# EAGLE design radish (EAGLE 4.16)

## Sheet 1 of 2
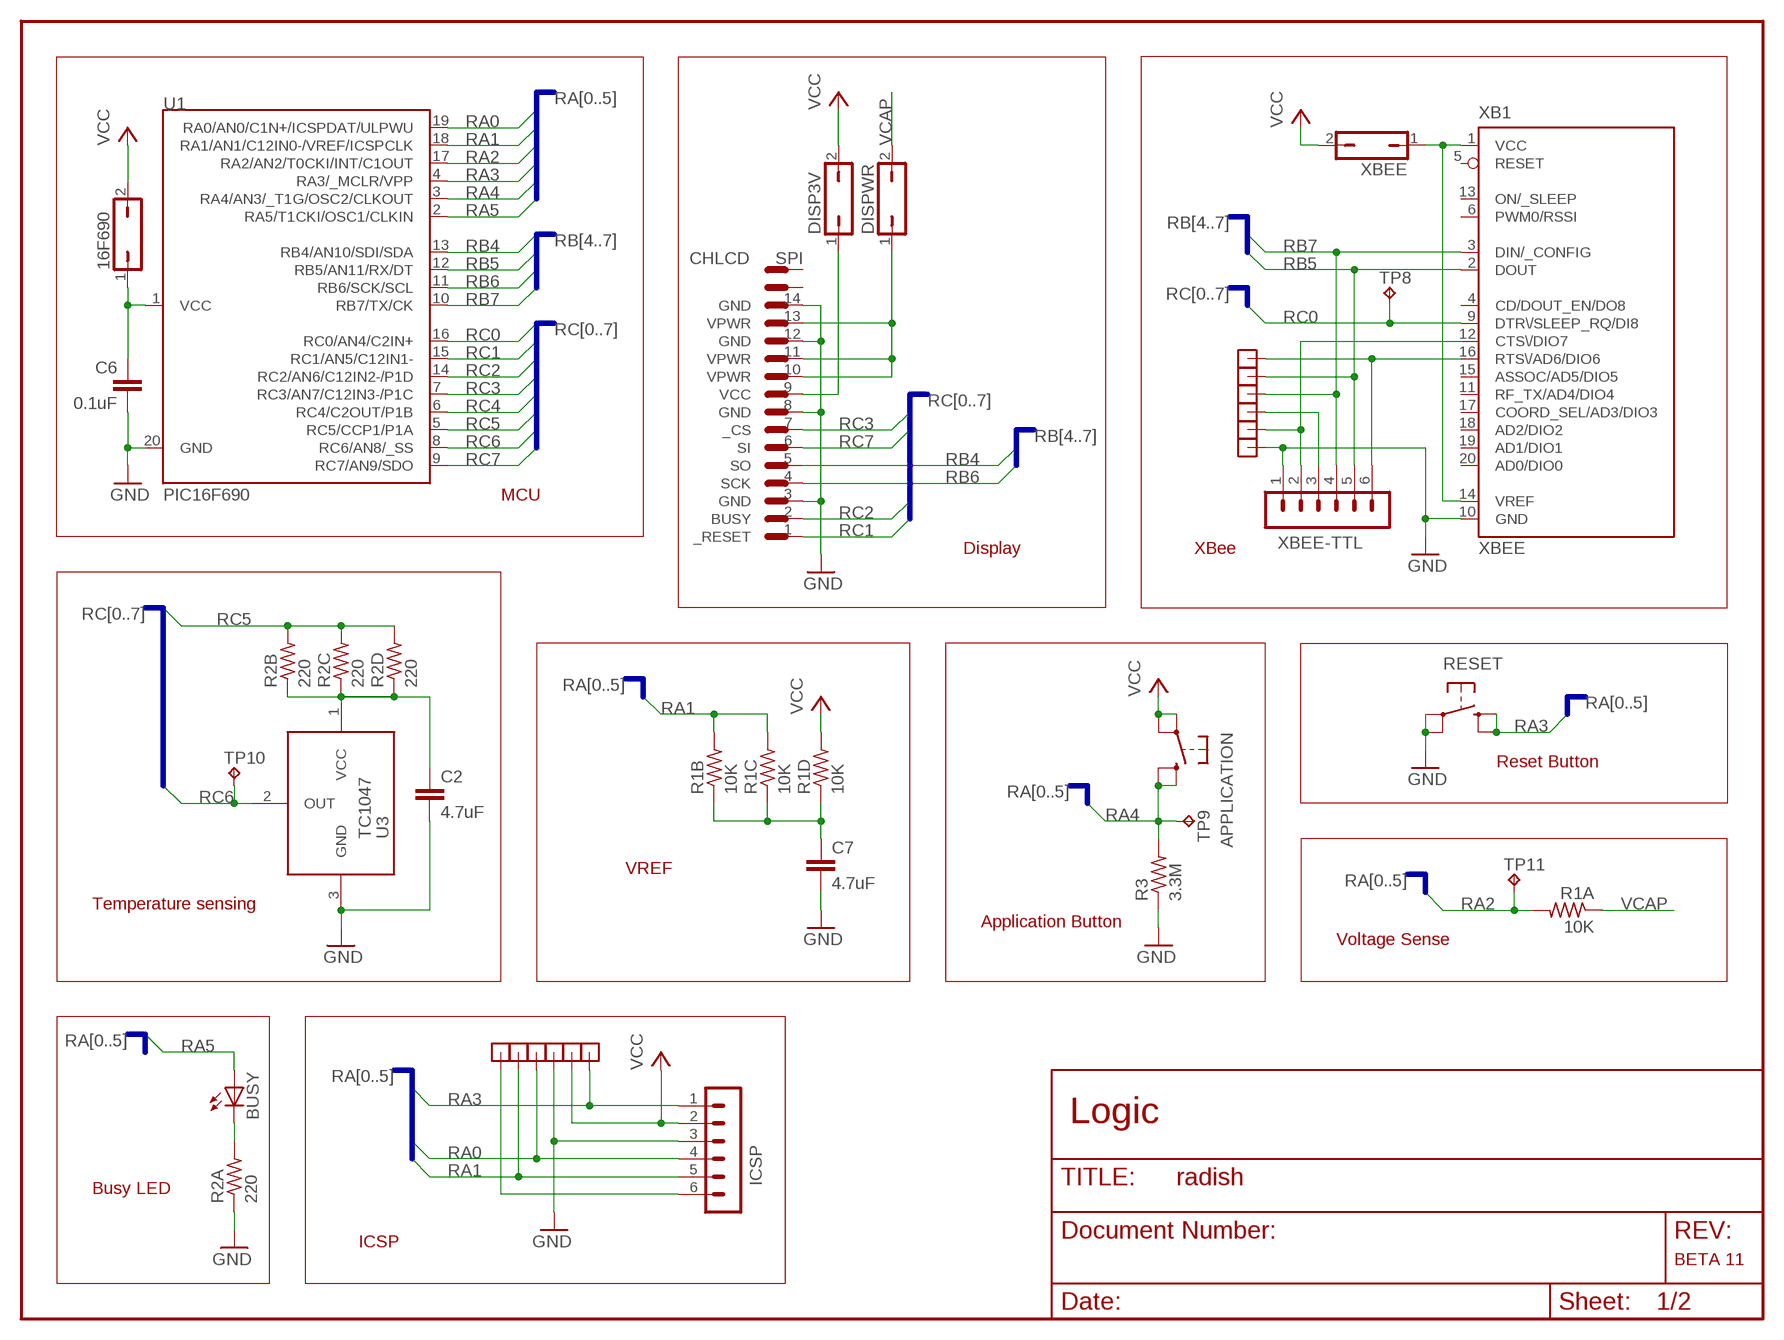
[diagram p0: schematic, sheet 1]

### Parts
16F690  JUMPER  [J0805]
APPLICATION  TL3301G  [TL3301*G]
BUSY  LEDCHIP-LED0805  [CHIP-LED0805]
C2  4.7uF  C-EUC0805  [C0805]
C6  0.1uF  C-EUC0805  [C0805]
C7  4.7uF  C-EUC0805  [C0805]
DISP3V  JUMPER  [J0805]
DISPWR  JUMPER  [J0805]
ICSP  SMT06-1  [SMT06-1]
R1  10K  CN1J4  [CN1J_NETWORK]
R2  220  CN1J4  [CN1J_NETWORK]
R3  3.3M  R-US_R0805  [R0805]
RESET  TL3301G  [TL3301*G]
SPI  CHLCD  SPI-LCDSMT  [16FMN-SMT-A-TF(LF)(SN)]
TP8  TPTP10R  [TP10R]
TP9  TPTP10R  [TP10R]
TP10  TPTP10R  [TP10R]
TP11  TPTP10R  [TP10R]
U1  PIC16F690  PIC16F690SOIC  [SOIC20S]
U3  TC1047  TEMP-SENSORSOT23  [SOT23]
X1  TESTPADROUND  [TESTPAD-ROUND]
X2  TESTPAD"  [TESTPAD-SQUARE]
X3  TESTPAD"  [TESTPAD-SQUARE]
X4  TESTPAD"  [TESTPAD-SQUARE]
X5  TESTPAD"  [TESTPAD-SQUARE]
X6  TESTPAD"  [TESTPAD-SQUARE]
X7  TESTPADROUND  [TESTPAD-ROUND]
X8  TESTPAD"  [TESTPAD-SQUARE]
X9  TESTPAD"  [TESTPAD-SQUARE]
X10  TESTPAD"  [TESTPAD-SQUARE]
X11  TESTPAD"  [TESTPAD-SQUARE]
X12  TESTPAD"  [TESTPAD-SQUARE]
XB1  XBEE  [XBEE]
XBEE  JUMPER  [J0805]
XBEE-TTL  SMT06-1  [SMT06-1]

### Nets
690-VCC [Power]: 16F690.1 C6.1 U1.1(VCC)
_CTS [Digital]: X8.PAD XB1.12(CTS\/DIO7) XBEE-TTL.2
_RTS [Digital]: X12.PAD XB1.16(RTS\/AD6/DIO6) XBEE-TTL.6
DISP-PWR [High Power]: DISPWR.1 SPI.10(VPWR) SPI.11(VPWR) SPI.13(VPWR)
DISP-VCC [Power]: DISP3V.1 SPI.9(VCC)
GND [High Power]: C2.2 C6.2 C7.2 ICSP.3 R2.1 R3.1 RESET.1(P) RESET.2(P1) SPI.3(GND) SPI.8(GND) SPI.12(GND) SPI.14(GND) U1.20(GND) U3.3(GND) X3.PAD X7.PAD XB1.10(GND) XBEE-TTL.1 ; also sheet 2
N$3 [Digital]: C2.1 R2.2 R2.3 R2.4 U3.1(VCC)
N$9: ICSP.6 X6.PAD
N$19 [Digital]: BUSY.C R2.8
PROG-VDD [Power]: X9.PAD XBEE-TTL.3
RA0 [Digital]: ICSP.4 U1.19(RA0/AN0/C1N+/ICSPDAT/ULPWU) X4.PAD
RA1 [Digital]: ICSP.5 R1.6 R1.7 U1.18(RA1/AN1/C12IN0-/VREF/ICSPCLK) X5.PAD
RA2 [Digital]: R1.8 TP11.TP U1.17(RA2/AN2/T0CKI/INT/C1OUT)
RA3 [Digital]: ICSP.1 RESET.3(S) RESET.4(S1) U1.4(RA3/_MCLR/VPP) X1.PAD
RA4 [Digital]: APPLICATION.3(S) APPLICATION.4(S1) R3.2 TP9.TP U1.3(RA4/AN3/_T1G/OSC2/CLKOUT)
RA5 [Digital]: BUSY.A U1.2(RA5/T1CKI/OSC1/CLKIN)
RB4 [Digital]: SPI.5(SO) U1.13(RB4/AN10/SDI/SDA)
RB5 [Digital]: U1.12(RB5/AN11/RX/DT) X11.PAD XB1.2(DOUT) XBEE-TTL.5
RB6 [Digital]: SPI.4(SCK) U1.11(RB6/SCK/SCL)
RB7 [Digital]: U1.10(RB7/TX/CK) X10.PAD XB1.3(DIN/_CONFIG) XBEE-TTL.4
RC0 [Digital]: TP8.TP U1.16(RC0/AN4/C2IN+) XB1.9(DTR\/SLEEP_RQ/DI8)
RC1 [Digital]: SPI.1(_RESET) U1.15(RC1/AN5/C12IN1-)
RC2 [Digital]: SPI.2(BUSY) U1.14(RC2/AN6/C12IN2-/P1D)
RC3 [Digital]: SPI.7(_CS) U1.7(RC3/AN7/C12IN3-/P1C)
RC4 [Digital]: U1.6(RC4/C2OUT/P1B)
RC5 [Digital]: R2.5 R2.6 R2.7 U1.5(RC5/CCP1/P1A)
RC6 [Digital]: TP10.TP U1.8(RC6/AN8/_SS) U3.2(OUT)
RC7 [Digital]: SPI.6(SI) U1.9(RC7/AN9/SDO)
VCAP [High Power]: DISPWR.2 R1.1 ; also sheet 2
VCC [High Power]: 16F690.2 APPLICATION.1(P) APPLICATION.2(P1) DISP3V.2 ICSP.2 R1.5 X2.PAD XBEE.2 ; also sheet 2
VREF: C7.1 R1.2 R1.3 R1.4
XBEE-VCC [High Power]: XB1.1(VCC) XB1.14(VREF) XBEE.1
Unconnected: SPI.15 SPI.16 XB1.4(CD/DOUT_EN/DO8) XB1.5(RESET) XB1.6(PWM0/RSSI) XB1.11(RF_TX/AD4/DIO4) XB1.13(ON/_SLEEP) XB1.15(ASSOC/AD5/DIO5) XB1.17(COORD_SEL/AD3/DIO3) XB1.18(AD2/DIO2) XB1.19(AD1/DIO1) XB1.20(AD0/DIO0)

### Buses
RA[0..5]
RB[4..7]
RC[0..7]

### Notes on the sheet
- MCU
- Display | XBee
- Reset Button
- Temperature sensing
- Application Button
- Voltage Sense
- Logic
- Busy LED
- ICSP
- BETA 11

## Sheet 2 of 2
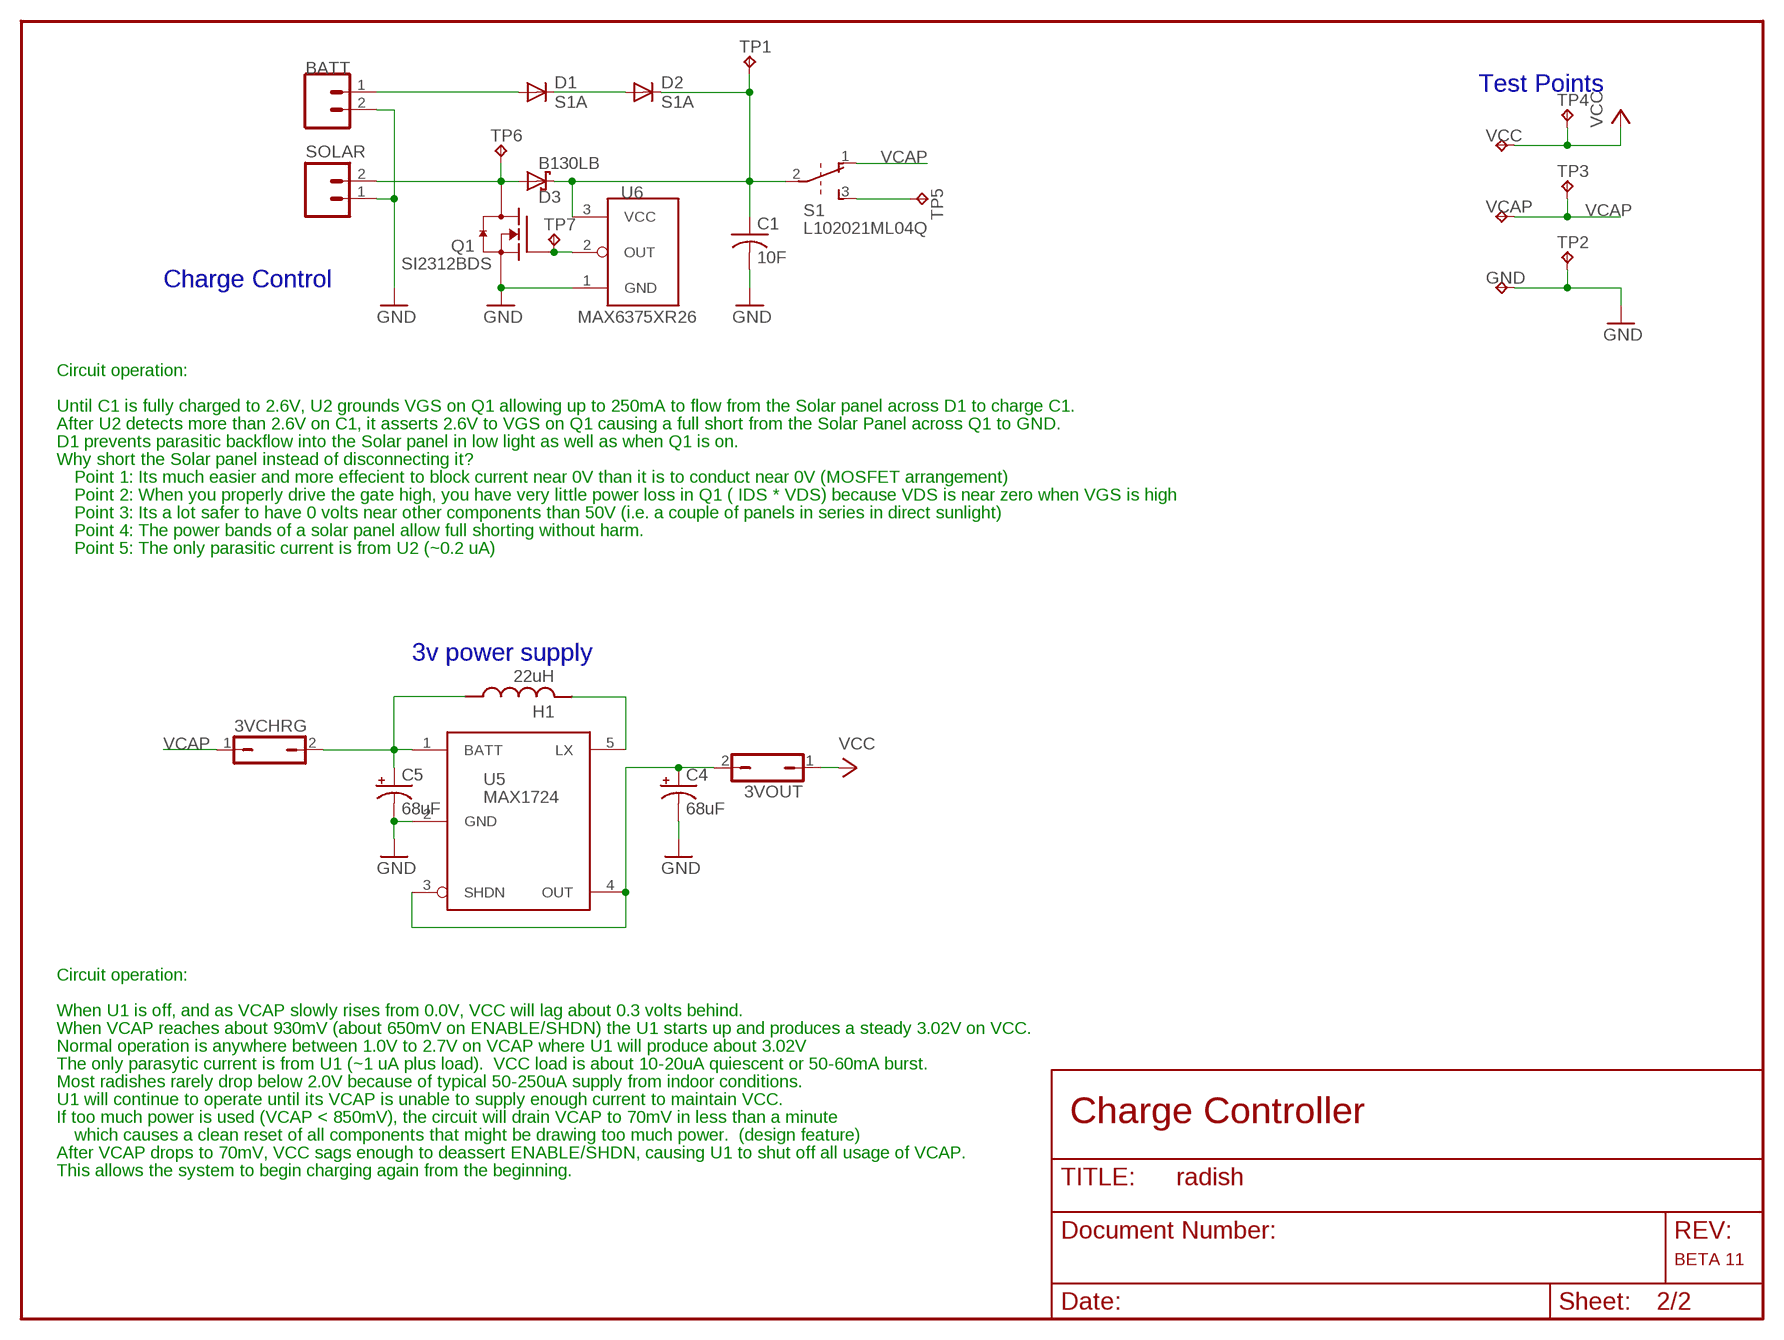
[diagram p1: schematic, sheet 2]

### Parts
3VCHRG  JUMPER  [J0805]
3VOUT  JUMPER  [J0805]
BATT  MA02  [02PA]
C1  10F  ESHR-001C0-002R7  [ESHR-HORIZ]
C4  68uF  CPOL-USD/7343-31R  [D/7343-31R]
C5  68uF  CPOL-USD/7343-31R  [D/7343-31R]
D1  S1A  DIODE-DO214AC  [DO214AC]
D2  S1A  DIODE-DO214AC  [DO214AC]
D3  B130LB  SCHOTTKY-DIODESMD  [SMB]
GND  TPTP15R  [TP15R]
H1  22uH  CDRH5D18  [CDRH5D18]
Q1  SI2312BDS  SI2312  [SOT23]
S1  L102021ML04Q  [L102*ML]
SOLAR  MA02  [02PA]
TP1  TPTP20R  [TP20R]
TP2  TPTP20R  [TP20R]
TP3  TPTP20R  [TP20R]
TP4  TPTP10R  [TP10R]
TP5  TPTP10R  [TP10R]
TP6  TPTP10R  [TP10R]
TP7  TPTP10R  [TP10R]
U5  MAX1724  [SOT23-5L]
U6  MAX6375XR26  MAX6375XR  [SC70-3L]
VCAP  TPTP15R  [TP15R]
VCC  TPTP15R  [TP15R]

### Nets
3VIN [High Power]: 3VCHRG.2 C5.+ H1.1 U5.1(BATT)
3VOUT [High Power]: 3VOUT.2 C4.+ U5.3(SHDN) U5.4(OUT)
GND [High Power]: BATT.2 C1.NEG C4.- C5.- GND.TP Q1.2(S) SOLAR.1 TP2.TP U5.2(GND) U6.1(GND) ; also sheet 1
LX [High Power]: H1.2 U5.5(LX)
N$1: S1.3(S) TP5.TP
N$2 [High Power]: BATT.1 D1.A
N$6: Q1.1(G) TP7.TP U6.2(OUT)
N$7 [Power]: D3.A Q1.3(D) SOLAR.2 TP6.TP
N$8 [High Power]: C1.POS D2.C D3.C S1.2(P) TP1.TP U6.3(VCC)
N$12 [High Power]: D1.C D2.A
VCAP [High Power]: 3VCHRG.1 S1.1(O) TP3.TP VCAP.TP ; also sheet 1
VCC [High Power]: 3VOUT.1 TP4.TP VCC.TP ; also sheet 1

### Notes on the sheet
- Test Points
- Charge Control
- Circuit operation:
- Until C1 is fully charged to 2.6V, U2 grounds VGS on Q1 allowing up to 250mA to flow from the Solar panel across D1 to charge C1.
- After U2 detects more than 2.6V on C1, it asserts 2.6V to VGS on Q1 causing a full short from the Solar Panel across Q1 to GND.
- D1 prevents parasitic backflow into the Solar panel in low light as well as when Q1 is on.
- Why short the Solar panel instead of disconnecting it?
- Point 1: Its much easier and more effecient to block current near 0V than it is to conduct near 0V (MOSFET arrangement)
- Point 2: When you properly drive the gate high, you have very little power loss in Q1 ( IDS * VDS) because VDS is near zero when VGS is high
- Point 3: Its a lot safer to have 0 volts near other components than 50V (i.e. a couple of panels in series in direct sunlight)
- Point 4: The power bands of a solar panel allow full shorting without harm.
- Point 5: The only parasitic current is from U2 (~0.2 uA)
- 3v power supply
- Circuit operation:
- When U1 is off, and as VCAP slowly rises from 0.0V, VCC will lag about 0.3 volts behind.
- When VCAP reaches about 930mV (about 650mV on ENABLE/SHDN) the U1 starts up and produces a steady 3.02V on VCC.
- Normal operation is anywhere between 1.0V to 2.7V on VCAP where U1 will produce about 3.02V
- The only parasytic current is from U1 (~1 uA plus load).  VCC load is about 10-20uA quiescent or 50-60mA burst.
- Most radishes rarely drop below 2.0V because of typical 50-250uA supply from indoor conditions.
- U1 will continue to operate until its VCAP is unable to supply enough current to maintain VCC.
- If too much power is used (VCAP < 850mV), the circuit will drain VCAP to 70mV in less than a minute | Charge Controller
- which causes a clean reset of all components that might be drawing too much power.  (design feature)
- After VCAP drops to 70mV, VCC sags enough to deassert ENABLE/SHDN, causing U1 to shut off all usage of VCAP.
- This allows the system to begin charging again from the beginning.
- BETA 11

## Library data of the parts
3VCHRG 3VOUT 16F690 DISP3V DISPWR XBEE = radish:JUMPER: Custom jumper with a trace connecting on the bottom
APPLICATION RESET = radish:TL3301: E-switch TL3301 series http://www.e-switch.com/pdf/TL3301.pdf
BATT SOLAR = con-amp-quick:MA02: AMP QUICK CONNECTOR
BUSY = led:LED: LED OSRAM: - CHIPLED LG R971, LG N971, LY N971, LG Q971, LY Q971, LO R971, LY R971 LH N974, LH R974 LS Q976, LO Q976, LY Q976 LO Q996 - Hyper CHIPLED LW Q18S LB Q993, LB Q99A, LB R99A - SideLED LS A670, LO A670, LY A670, LG A670, LP A670 LB A673, LV A673, LT A673, LW A673 LH A674 LY A675 LS A676, LA A676, LO A676, LY A676, LW A676 LS A679, LY A679, LG A679 - Hyper Micro SIDELED® LS Y876, LA Y876, LO Y876, LY Y876 LT Y87S - SmartLED LW L88C, LW L88S LB L89C, LB L89S, LG L890 LS L89K, LO L89K, LY L89K LS L896, LA L896, LO L896, LY L896 - TOPLED LS T670, LO T670, LY T670, LG T670, LP T670 LSG T670, LSP T670, LSY T670, LOP T670, LYG T670 LG T671, LOG T671, LSG T671 LB T673, LV T673, LT T673, LW T673 LH T674 LS T676, LA T676, LO T676, LY T676, LB T676, LH T676, LSB T676, LW T676 LB T67C, LV T67C, LT T67C, LS T67K, LO T67K, LY T67K, LW E67C LS E67B, LA E67B, LO E67B, LY E67B, LB E67C, LV E67C, LT E67C LW T67C LS T679, LY T679, LG T679 LS T770, LO T770, LY T770, LG T770, LP T770 LB T773, LV T773, LT T773, LW T773 LH T774 LS E675, LA E675, LY E675, LS T675 LS T776, LA T776, LO T776, LY T776, LB T776 LHGB T686 LT T68C, LB T68C - Hyper Mini TOPLED® LB M676 - Mini TOPLED Santana® LG M470 LS M47K, LO M47K, LY M47K Source: http://www.osram.convergy.de - LUMILED® LXK2-PW12-R00, LXK2-PW12-S00, LXK2-PW14-U00, LXK2-PW14-V00 LXK2-PM12-R00, LXK2-PM12-S00, LXK2-PM14-U00 LXK2-PE12-Q00, LXK2-PE12-R00, LXK2-PE12-S00, LXK2-PE14-T00, LXK2-PE14-U00 LXK2-PB12-K00, LXK2-PB12-L00, LXK2-PB12-M00, LXK2-PB14-N00, LXK2-PB14-P00, LXK2-PB14-Q00 LXK2-PR12-L00, LXK2-PR12-M00, LXK2-PR14-Q00, LXK2-PR14-R00 LXK2-PD12-Q00, LXK2-PD12-R00, LXK2-PD12-S00 LXK2-PH12-R00, LXK2-PH12-S00 LXK2-PL12-P00, LXK2-PL12-Q00, LXK2-PL12-R00 Source: www.luxeon.com
C1 = radish:ESHR-001C0-002R7: 10F Ultracap
C2 C6 C7 = rcl:C-EU: CAPACITOR, European symbol
C4 C5 = rcl:CPOL-US: POLARIZED CAPACITOR, American symbol
D1 D2 = diode:DIODE-: DIODE
D3 = diode:SCHOTTKY-DIODE: Schottky Diode
GND TP1-TP11 VCAP VCC = testpad:TP
H1 = radish:CDRH5D18: Sumida inductors
ICSP XBEE-TTL = radish:SMT06-1: PIN HEADER
Q1 = radish-new:SI2312
R1 R2 = radish:CN1J4: CN1J4 series 4-resistor arrays from KOA Steers Example part: http://www.mouser.com/Search/ProductDetail.aspx?R=660-CN1J4TTD103J
R3 = rcl:R-US_: RESISTOR, American symbol
S1 = radish:L102021ML04Q: Power Switch Digikey Part CKC5102-ND
SPI = radish:SPI-LCD
U1 = radish:PIC16F690
U3 = radish:TEMP-SENSOR: One of the several analog temperature sensors from Microchip, such as the MCP9700 or theTC1047
U5 = radish:MAX1724
U6 = radish:MAX6375
X1-X12 = radish:TESTPAD
XB1 = radish:XBEE: XBee (TM) /XBee-PRO(TM) OEM RF Modules Source: MaxStream, Inc. xbee_productmanual.pdf

## Net classes
1 Power: width 0.406 mm, drill 0.279 mm, clearance 0.508 mm
2 Digital: width 0.305 mm
3 High Power: width 0.61 mm, drill 0.279 mm, clearance 0.762 mm

## Board
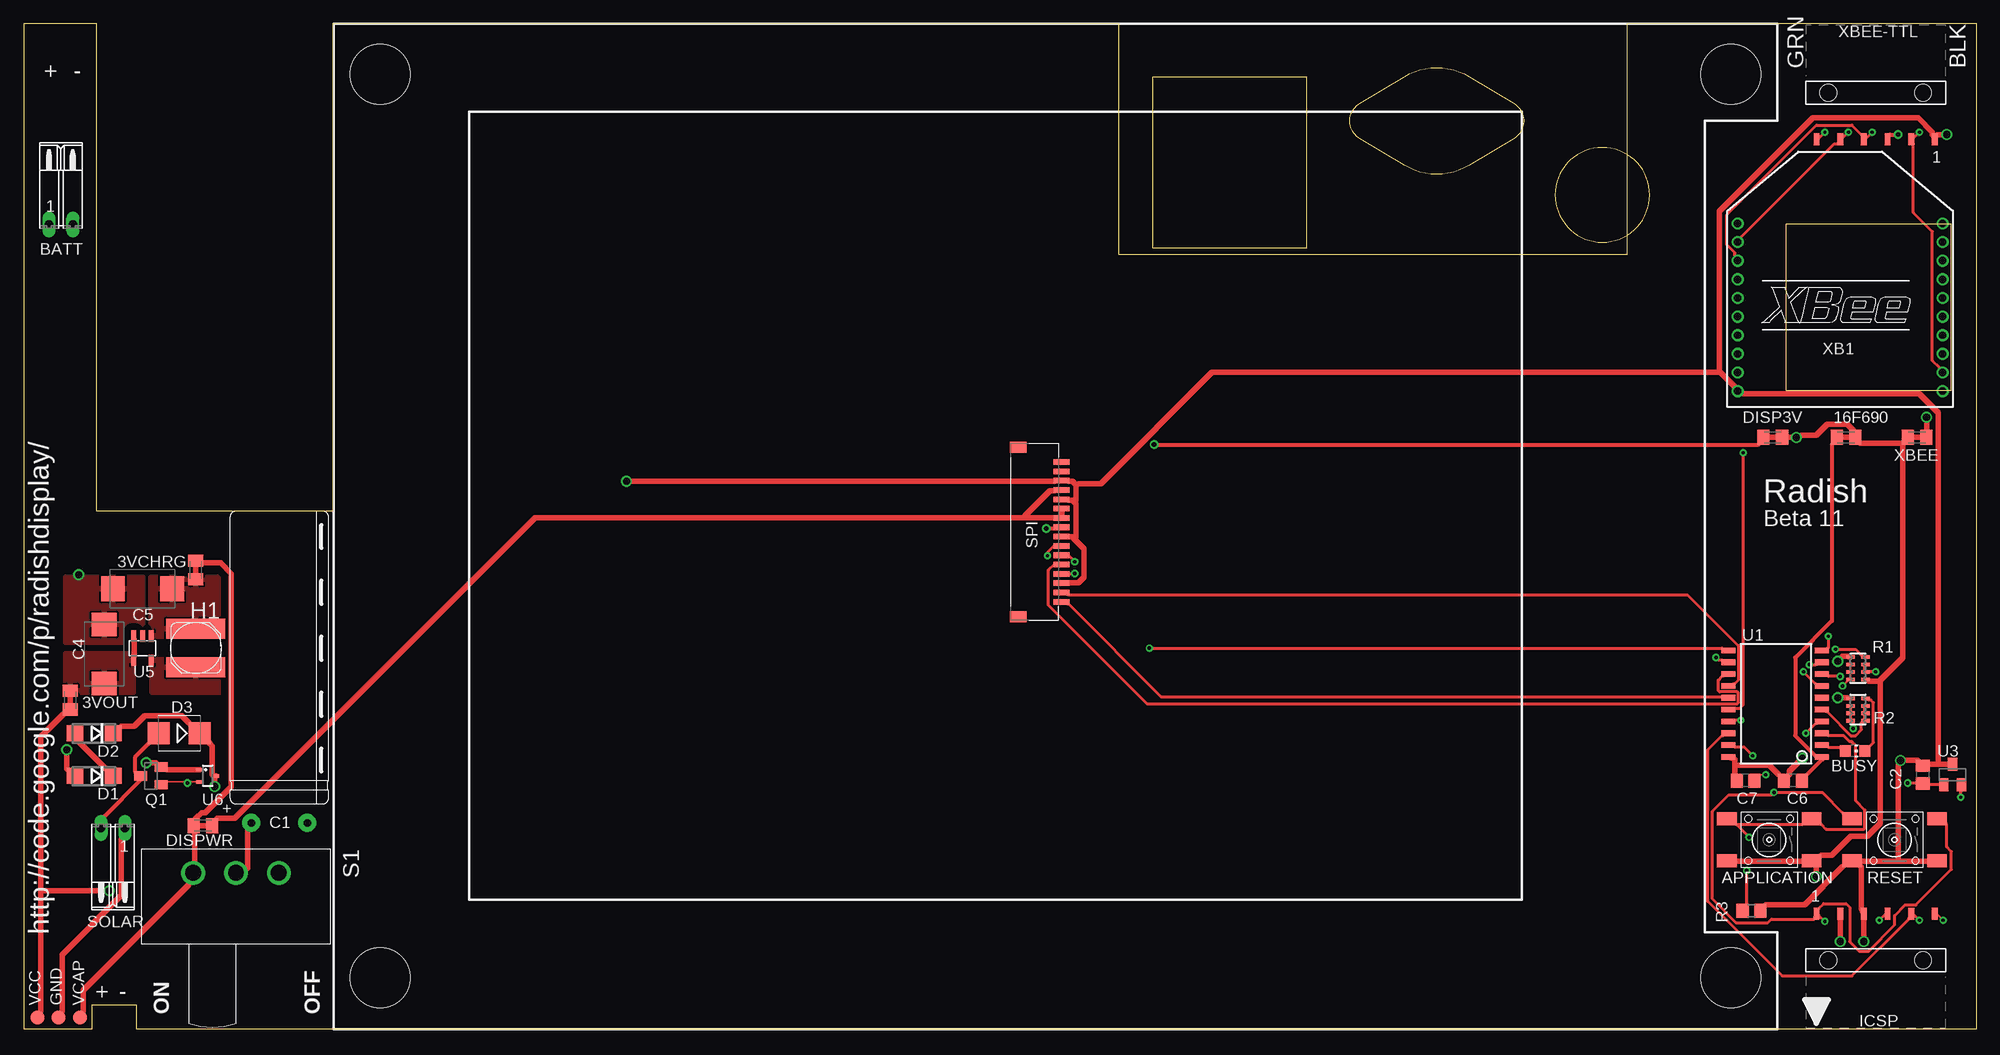
[diagram p2: board, top side]
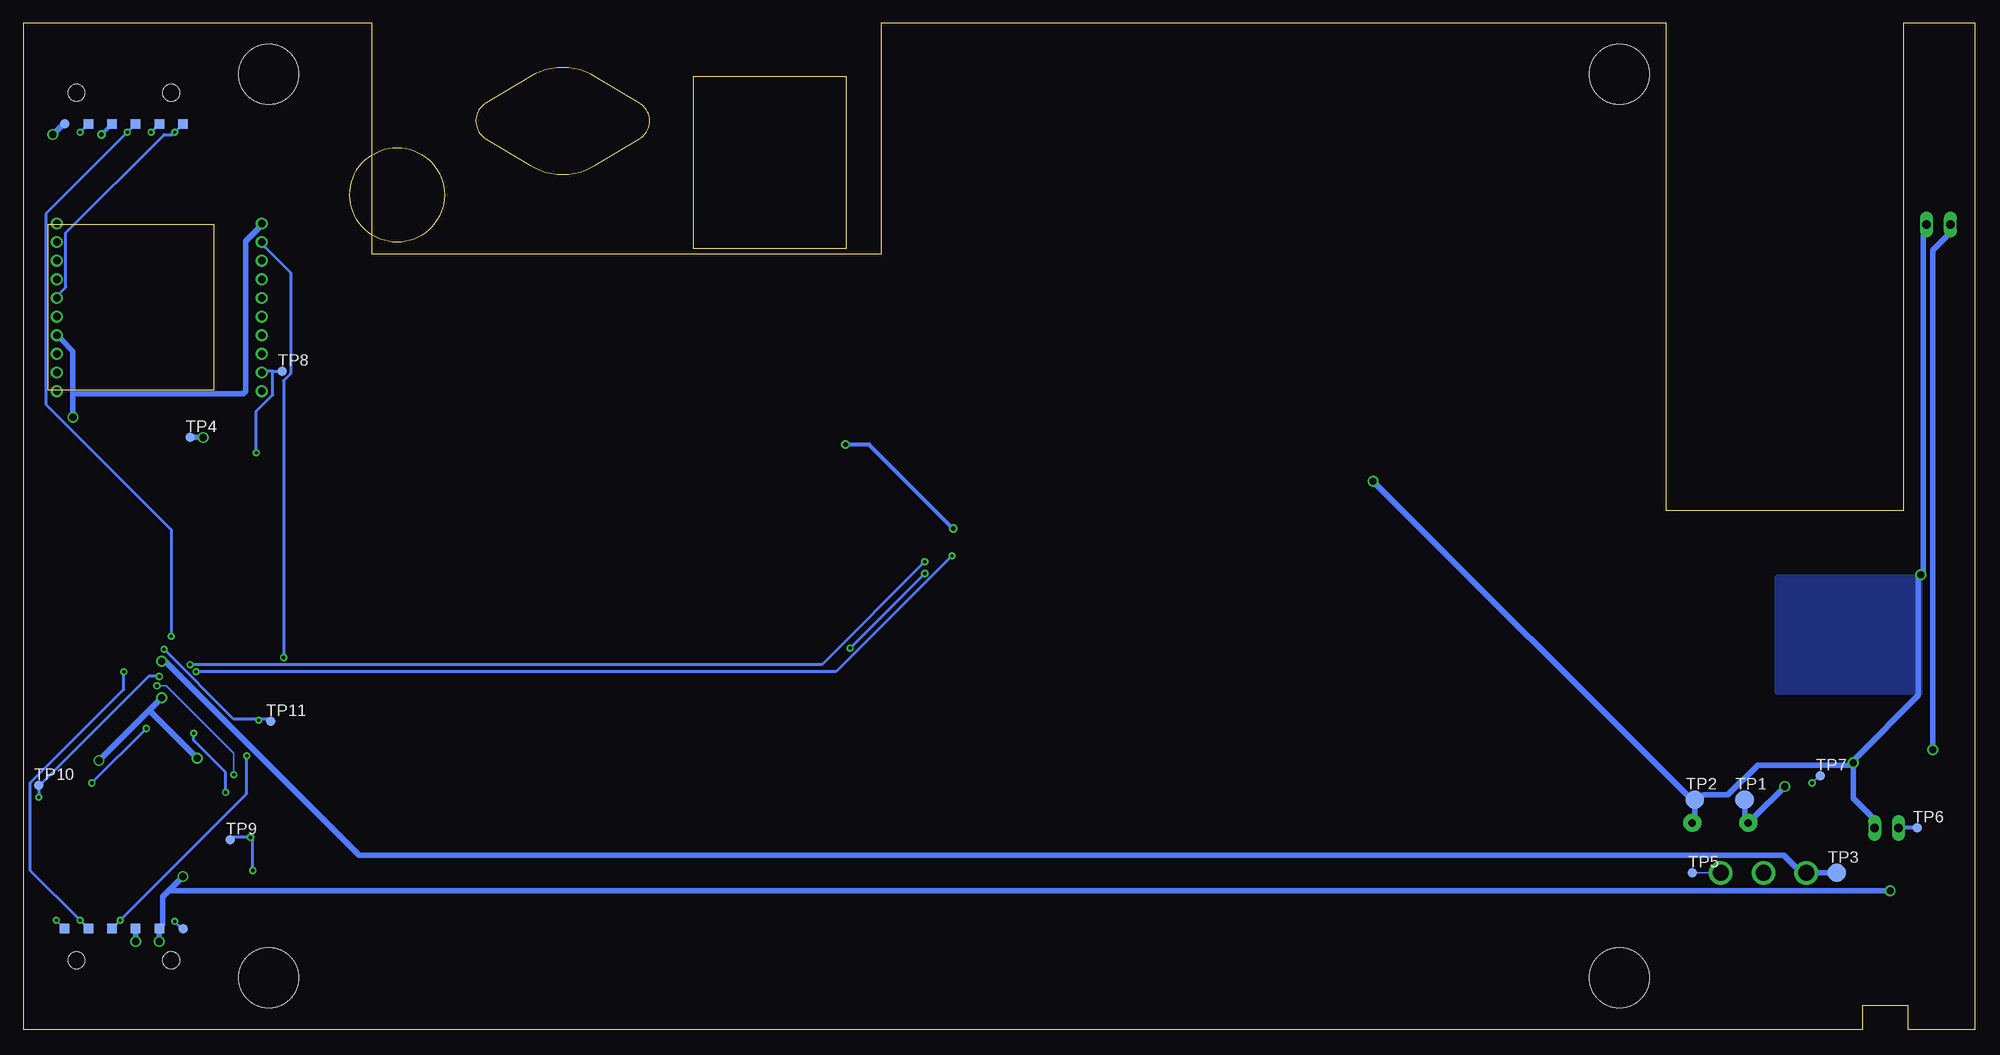
[diagram p3: board, bottom side, seen from below]

Size 209.55 x 107.95 mm. Coordinates in mm from the lower left corner, seen from the top.
Outline: 0,107.95 7.75,107.95 7.75,55.63 33.15,55.63 33.15,107.95 117.48,107.95 117.48,83.19 172.08,83.19 172.08,107.95 209.55,107.95 209.55,0 12.06,0 12.06,2.54 7.24,2.54 7.24,0 0,0 0,107.95
Copper layers (1+16): Top 0.0178mm / dielectric 1.4986mm / Bottom 0.0178mm
Design rules "SSC-EagleDRU_2LyrBeta_v1.3": minimum track width 6mil, minimum drill 14mil, track to track 6mil, track to pad 6mil, pad to pad 6mil, via to via 6mil, smd to smd 6mil, copper to edge 20mil, drill to drill 16mil, minimum pad ring 8mil, minimum via ring 8mil, stop-mask expansion 3mil, vias tented up to drill 0mil, thermal gap 10mil
Holes 6.45 mm at 38.21,5.5 38.21,102.5 183.22,102.5 183.22,5.5
tRestrict: area 34.4,98.7 to 42,106.3; area 179.4,98.7 to 187,106.3; area 34.4,1.6 to 42,9.3; area 179.4,1.6 to 187,9.3; area 1.9,39.9 to 3.4,50.4; area 3.4,49.5 to 14,50.4; area 186.1,68.6 to 203.8,86.4
bRestrict: area 34.4,98.7 to 42,106.3; area 179.4,98.7 to 187,106.3; area 34.4,1.6 to 42,9.3; area 179.4,1.6 to 187,9.3; area 186.1,68.6 to 203.8,86.4
vRestrict: area 34.4,98.7 to 42,106.3; area 179.4,98.7 to 187,106.3; area 34.4,1.6 to 42,9.3; area 179.4,1.6 to 187,9.3
Milling: area 142.3,91.7 to 161,103.2; area 121.2,83.8 to 137.7,102.2; area 164.3,84.5 to 174.5,94.6; area 189.1,68.6 to 206.9,86.4

### Footprints (pad centres in the part's own frame; a part is rotated, then mirrored left to right if it is on the bottom)
J0805 = smd 1.6 x 1.3: 1 0,-1; 2 0,1
TL3301*G = smd 2.1 x 1.4: 1 -4.55,2.25; 2 4.55,2.25; 3 -4.55,-2.25; 4 4.55,-2.25
02PA = drill 0.914 long: 1 -1.27,0; 2 1.27,0
CHIP-LED0805 = smd 1.2 x 1.2: A 0,-1.05; C 0,1.05
ESHR-HORIZ = drill 0.8 pad 1.93 round: NEG -2,2; POS -2,8
C0805 = smd 1.3 x 1.5: 1 -0.95,0; 2 0.95,0
D/7343-31R = smd 2.55 x 2.7: + 3.175,0; - -3.175,0
DO214AC = smd 1.8 x 1.7: A 2.05,0; C -2.05,0
SMB = smd 2.4 x 2.4: A 2.2,0; C -2.2,0
TP15R = smd 1.5 x 1.5: TP 0,0
CDRH5D18 = smd 2.15 x 6.3: 1 -2.08,0; 2 2.08,0
SMT06-1 = smd 0.635 x 1.27: 1 -6.35,0; 2 -3.81,0; 3 -1.27,0; 4 1.27,0; 5 3.81,0; 6 6.35,0 | hole 1.803: -5.08,-4.999; 5.08,-4.999
SOT23 = smd 1 x 1.4: 1 -0.95,-1.1; 2 0.95,-1.1; 3 0,1.1
CN1J_NETWORK = smd 0.4 x 0.9: 1 -1.2,-0.8; 2 -0.4,-0.8; 3 0.4,-0.8; 4 1.2,-0.8; 5 1.2,0.8; 6 0.4,0.8; 7 -0.4,0.8; 8 -1.2,0.8
R0805 = smd 1.3 x 1.5: 1 -0.95,0; 2 0.95,0
L102*ML = drill 1.702 round: 1 2.54,5.563; 2 2.54,10.16; 3 2.54,14.757
16FMN-SMT-A-TF(LF)(SN) = smd 0.6 x 1.7: 1 0,0; 2 1,0; 3 2,0; 4 3,0; 5 4,0; 6 5,0; 7 6,0; 8 7,0; 9 8,0; 10 9,0; 11 10,0; 12 11,0; 13 12,0; 14 13,0; 15 14,0; 16 15,0 | smd 1.2 x 1.8: P$17 -1.6,4.65; P$18 16.6,4.65
TP20R = smd 2 x 2: TP 0,0
TP10R = smd 1 x 1: TP 0,0
SOIC20S = smd 0.6 x 1.5: 1 -5.715,-5; 2 -4.445,-5; 3 -3.175,-5; 4 -1.905,-5; 5 -0.635,-5; 6 0.635,-5; 7 1.905,-5; 8 3.175,-5; 9 4.445,-5; 10 5.715,-5; 11 5.715,5; 12 4.445,5; 13 3.175,5; 14 1.905,5; 15 0.635,5; 16 -0.635,5; 17 -1.905,5; 18 -3.175,5; 19 -4.445,5; 20 -5.715,5
SOT23-5L = smd 0.55 x 1.2: 1 -0.95,-1.3; 2 0,-1.3; 3 0.95,-1.3; 4 0.95,1.3; 5 -0.95,1.3
SC70-3L = smd 0.35 x 0.8: 1 -0.65,-0.85; 2 0.65,-0.85; 3 0,0.85
TESTPAD-ROUND = smd 1.016 x 1.016: PAD 0,0
TESTPAD-SQUARE = smd 1.016 x 1.016: PAD 0,0
XBEE = drill 0.8 pad 1.27 round: 1 -11,7.73; 2 -11,5.73; 3 -11,3.73; 4 -11,1.73; 5 -11,-0.27; 6 -11,-2.27; 7 -11,-4.27; 8 -11,-6.27; 9 -11,-8.27; 10 -11,-10.27; 11 11,-10.27; 12 11,-8.27; 13 11,-6.27; 14 11,-4.27; 15 11,-2.27; 16 11,-0.27; 17 11,1.73; 18 11,3.73; 19 11,5.73; 20 11,7.73

### Placement (x,y rotation side)
3VCHRG  18.42,49.28 180 top
3VOUT  4.95,35.31 0 top
16F690  195.58,63.5 270 top
APPLICATION  187.32,20.32 180 top
BATT  3.94,86.36 0 top
BUSY  196.53,29.84 270 top
C1  32.38,24.13 90 top
C2  203.83,27.3 90 top
C4  8.57,40.26 270 top
C5  12.7,47.24 0 top
C6  189.86,26.67 180 top
C7  184.78,26.67 180 top
D1  7.49,27.18 180 top
D2  7.49,31.75 180 top
D3  16.64,31.75 180 top
DISP3V  187.71,63.5 270 top
DISPWR  19.18,21.84 90 top
GND  3.68,1.27 0 top
H1  18.42,40.89 270 top
ICSP  198.75,12.38 0 top
Q1  13.59,27.18 90 top
R1  196.85,38.73 270 top
R2  196.85,34.29 270 top
R3  185.42,12.7 180 top
RESET  200.79,20.32 180 top
S1  12.57,19.3 270 top
SOLAR  9.52,21.59 180 top
SPI  111.36,45.86 90 top
TP1  24.77,24.64 0 bottom
TP2  30.1,24.64 0 bottom
TP3  14.86,16.76 0 bottom
TP4  191.64,63.5 0 bottom
TP5  30.35,16.76 0 bottom
TP6  6.22,21.59 0 bottom
TP7  16.64,27.18 0 bottom
TP8  181.74,70.61 0 bottom
TP9  187.32,20.32 0 bottom
TP10  207.9,26.16 0 bottom
TP11  183.01,33.02 0 bottom
U1  187.96,34.92 90 top
U3  207.01,27.3 0 top
U5  12.7,40.89 180 top
U6  19.69,27.18 270 top
VCAP  5.97,1.27 90 top
VCC  1.4,1.27 270 top
X1  192.41,10.79 90 bottom
X2  194.94,10.79 90 bottom
X3  197.48,10.79 90 bottom
X4  200.02,10.79 90 bottom
X5  202.56,10.79 90 bottom
X6  205.1,10.79 90 bottom
X7  205.1,97.16 180 bottom
X8  202.56,97.16 180 bottom
X9  200.02,97.16 180 bottom
X10  197.48,97.16 180 bottom
X11  194.94,97.16 180 bottom
X12  192.41,97.16 180 bottom
XB1  194.94,78.74 0 top
XBEE  203.2,63.5 90 top
XBEE-TTL  198.75,95.5 180 top

### Tracks (layer width: path | path; a pad name or v marks a point on that pad's centre or on a via)
3VIN
  pour Top: 21.27,42.16 13.65,42.16 13.65,48.51 21.27,48.51
3VOUT
  Top 0.61: U5.3 11.81,41.66 11.81,40.13 U5.4
  pour Top: 4.45,40.26 11.68,40.26 11.68,36.13 4.45,36.13
690-VCC
  Top 0.406: C6.1 191.39,27.3 193.04,28.96 U1.1 192.28,29.34 190.12,31.5 190.12,39.88 194.06,43.81 194.06,62.74 16F690.1
_CTS  (via drill 0.36)
  Top 0.305: v203.45,96.27 202.82,95.63 XBEE-TTL.2 202.82,95 202.82,87.63 204.85,85.6 204.85,71.75 205.61,70.99 XB1.12
  Bottom 0.305: v203.45,96.27 X8.PAD
_RTS  (via drill 0.36)
  Top 0.305: v193.29,96.27 192.66,95.63 XBEE-TTL.6
  Bottom 0.305: X12.PAD v193.29,96.27 193.55,96.01 194.44,96.01 204.98,85.47 204.98,79.63 205.61,78.99 XB1.16
DISP-PWR
  Top 0.61: 107.44,54.86 110.62,54.86 SPI.10 111.38,55.12 111.38,55.63 SPI.11 | 107.44,54.86 54.86,54.86 22.61,22.61 20.7,22.61 DISPWR.1 | SPI.13 110.62,57.78 110.11,57.78 107.44,55.12 107.44,54.86
DISP-VCC  (via drill 0.51)
  Top 0.406: v121.29,62.74 186.18,62.74 DISP3V.1 | v109.73,53.72 110.62,53.72 SPI.9
  Bottom 0.406: v121.29,62.74 118.75,62.74 v109.73,53.72
GND  (via drill 0.76)
  Top 0.61: v5.84,48.77 5.84,48.51 | U6.1 18.54,27.81 15.37,27.81 Q1.2 14.1,28.57 v13.08,28.57 | GND.TP 4.06,1.91 4.06,8 10.41,14.35 10.41,20.32 SOLAR.1 | v197.48,9.4 ICSP.3 197.23,12.95 197.23,17.4 RESET.2 | R3.1 186.94,13.34 191.13,13.34 195.2,17.4 RESET.2 | 201.17,18.03 197.23,18.03 RESET.2 | 201.17,18.03 204.34,18.03 RESET.1 | 183.64,28.32 183.64,28.96 U1.20 | 183.64,28.32 183.64,27.3 C7.2 | 183.64,28.32 187.32,28.32 188.34,27.3 C6.2 189.48,27.3 189.48,27.69 v190.88,29.08 | v194.69,35.56 195.71,35.56 R2.1 | 205.49,28.45 204.47,28.45 C2.2 203.2,28.83 v201.42,28.83 201.17,28.32 201.17,18.03 | 205.49,28.45 206.63,28.45 U3.3 | 112.71,52.64 112.52,52.83 112.14,52.83 SPI.8 | 112.71,52.64 113.79,51.56 113.79,48.51 113.16,47.88 112.14,47.88 SPI.3 | 112.71,56.58 112.9,56.39 112.9,52.83 112.71,52.64 | 112.71,56.58 112.52,56.77 112.14,56.77 SPI.12 | 112.9,58.42 112.52,58.8 112.14,58.8 SPI.14 110.62,58.8 v64.64,58.8 | 112.9,58.42 112.9,56.77 112.71,56.58 | v206.38,96.01 205.36,96.01 XBEE-TTL.1 204.85,96.01 204.85,96.27 203.33,97.79 192.02,97.79 181.99,87.76 181.99,70.61 | 181.99,70.61 183.64,68.96 XB1.10 184.53,68.2 203.45,68.2 205.49,66.17 205.49,28.45 | 112.9,58.42 113.16,58.55 115.57,58.55 127.51,70.48 181.74,70.48 181.99,70.61
  Bottom 0.61: BATT.2 5.59,85.09 5.59,49.02 v5.84,48.77 6.1,48.26 6.1,35.81 12.83,29.08 v13.08,28.57 | TP2.TP 30.1,22.99 C1.NEG | v13.08,28.57 13.08,24.77 11.18,22.86 SOLAR.1 | TP2.TP 29.21,25.15 26.54,25.15 23.37,28.32 13.59,28.32 v13.08,28.57 | v197.48,9.4 X3.PAD | v201.42,28.83 196.02,34.23 | 196.02,34.23 v194.69,35.56 | 196.02,34.23 v190.88,29.08 | v206.38,96.01 205.49,96.9 X7.PAD | v64.64,58.8 30.99,25.15 TP2.TP
  pour Top: 4.45,41.53 10.79,41.53 10.79,42.16 12.7,42.16 12.7,48.51 4.45,48.51
  pour Bottom (rank 2): 21.27,48.51 21.27,36.13 4.45,36.13 4.45,48.51
LX
  pour Top: 21.27,39.62 21.27,36.13 13.72,36.13 13.72,39.62
N$1
  Bottom 0.152: S1.3 TP5.TP
N$2  (via drill 0.76)
  Top 0.61: v4.57,29.97 4.57,27.94 D1.A
  Bottom 0.61: v4.57,29.97 4.57,83.57 3.05,85.09 BATT.1
N$3  (via drill 0.36)
  Top 0.305: R2.2 196.09,34.54 196.09,34.04 R2.3 196.09,33.78 196.09,33.27 R2.4 196.34,32.89 v196.34,32.26 | U3.1 205.61,26.29 204.47,26.29 C2.1 203.2,26.42 v202.18,26.42
  Bottom 0.305: v202.18,26.42 v196.34,32.26
N$6  (via drill 0.36)
  Top 0.152: 17.53,26.54 15.37,26.54 Q1.1 | 17.53,26.54 18.54,26.54 U6.2 | 17.53,26.54 v17.53,26.42
  Bottom 0.152: v17.53,26.42 17.02,26.92 TP7.TP
N$7
  Top 0.406: D3.A 13.33,30.61 11.94,29.21 11.94,27.56 Q1.3 12.57,26.8 8.64,22.86 SOLAR.2
  Bottom 0.406: TP6.TP SOLAR.2
N$8  (via drill 0.76)
  Top 0.61: D2.C 10.41,32.51 11.81,32.51 12.95,33.66 16.89,33.66 17.65,32.89 D3.C 19.94,30.61 20.19,30.35 20.19,27.3 U6.3 20.45,26.92 v20.45,26.04 | C1.POS 24,21.21 24,17.27 S1.2
  Bottom 0.61: TP1.TP 24.77,22.99 C1.POS 23.75,22.73 v20.45,26.04
N$9  (via drill 0.36)
  Top 0.152: v205.99,11.68 205.36,12.32 ICSP.6
  Bottom 0.152: v205.99,11.68 X6.PAD
N$12
  Top 0.61: D1.C 8.76,27.94 5.71,30.99 D2.A
N$19
  Top 0.305: R2.8 197.99,35.31 198.25,35.31 198.5,35.05 198.5,30.73 198.12,30.35 BUSY.C
PROG-VDD  (via drill 0.51)
  Top 0.406: v201.17,96.01 200.28,96.01 XBEE-TTL.3
  Bottom 0.406: v201.17,96.01 X9.PAD
RA0  (via drill 0.36)
  Top 0.305: v199.14,11.68 199.77,12.32 ICSP.4 | v185.55,29.34 184.66,30.23 183.64,30.23 U1.19
  Bottom 0.305: X4.PAD v199.14,11.68 185.55,25.27 v185.55,29.34
RA1  (via drill 0.36)
  Top 0.305: R1.7 197.61,38.99 197.61,38.48 R1.6 197.99,38.35 v198.75,38.35 | v203.45,11.68 202.82,12.32 ICSP.5 202.31,11.81 196.22,5.71 188.72,5.71 180.72,13.72 180.72,29.97 182.25,31.5 U1.18
  Bottom 0.305: X5.PAD v203.45,11.68 208.79,17.02 208.79,26.42 198.75,36.45 v198.75,38.35
RA2  (via drill 0.36)
  Top 0.305: v194.44,40.77 196.6,40.77 197.23,40.13 R1.8 | v184.28,33.15 183.64,33.15 U1.17
  Bottom 0.305: v194.44,40.77 186.94,33.27 184.28,33.27 | 184.28,33.27 183.39,33.27 TP11.TP | 184.28,33.27 v184.28,33.15
RA3  (via drill 0.36)
  Top 0.305: v193.29,11.56 192.66,12.19 ICSP.1 | v191.26,31.75 192.28,32.77 U1.4 | RESET.4 195.2,23.24 193.04,25.4 v187.83,25.4 187.58,25.15 183.01,25.15 181.23,23.37 181.23,13.97 183.77,11.43 187.2,11.43 187.58,11.81 192.15,11.81 ICSP.1 | RESET.3 206.38,21.97 206.38,19.56 206.88,19.05 206.88,17.14 203.07,13.34 201.93,13.34 200.79,12.19 200.79,11.18 197.99,8.38 196.98,8.38 195.96,9.4 195.96,13.08 195.58,13.46 193.17,13.46 192.66,12.95 ICSP.1
  Bottom 0.305: v193.29,11.56 192.79,11.05 X1.PAD | v191.26,31.75 191.26,30.99 187.83,27.56 v187.83,25.4
RA4  (via drill 0.36)
  Top 0.305: U1.3 193.67,31.5 195.33,31.5 195.96,30.86 196.22,30.86 196.6,30.48 196.6,24.51 197.61,23.5 197.61,21.59 197.48,21.46 193.42,21.46 192.91,21.97 APPLICATION.3 190.88,21.97 183.9,21.97 183.83,21.91 | 183.83,21.91 183.77,21.97 APPLICATION.4 | v185.17,20.57 183.83,21.91 | v184.91,17.02 184.91,13.34 R3.2
  Bottom 0.305: TP9.TP 186.94,20.57 v185.17,20.57 184.91,20.32 v184.91,17.02
RA5
  Top 0.305: BUSY.A 194.94,30.23 193.67,30.23 U1.2
RB4
  Top 0.305: U1.13 182.25,37.85 181.86,37.47 181.86,36.32 181.99,36.2 183.9,36.2 184.02,36.07 184.02,35.05 183.9,34.92 120.52,34.92 109.98,45.47 109.98,49.28 110.62,49.91 SPI.5
RB5  (via drill 0.36)
  Top 0.305: v195.83,96.27 195.2,95.63 XBEE-TTL.5 194.69,95 194.31,95 184.28,84.96 XB1.2 | v181.61,39.88 181.86,39.62 182.25,39.62 U1.12
  Bottom 0.305: v195.83,96.27 X11.PAD | v181.61,39.88 181.61,69.6 180.85,70.36 180.85,81.15 183.64,83.95 XB1.2
RB6  (via drill 0.36)
  Top 0.305: v120.78,40.89 182.25,40.89 U1.11 | v112.78,48.9 112.14,48.9 SPI.4
  Bottom 0.305: v112.78,48.9 v120.78,40.89
RB7  (via drill 0.36)
  Top 0.305: v198.37,96.27 197.74,95.63 XBEE-TTL.4 197.23,96.01 196.22,97.03 192.41,97.03 182.75,87.38 182.75,84.2 183.64,83.31 183.64,83.06 XB1.3 | v193.67,42.16 193.67,40.89 U1.10
  Bottom 0.305: X10.PAD v198.37,96.27 207.14,87.5 207.14,67.06 193.67,53.59 v193.67,42.16
RC0  (via drill 0.36)
  Top 0.305: v184.53,61.85 184.53,34.8 184.15,34.42 183.64,34.42 U1.16
  Bottom 0.305: 182.75,70.61 183.39,70.61 XB1.9 | 182.75,70.61 TP8.TP | v184.53,61.85 184.53,66.29 182.75,68.07 182.75,70.61
RC1
  Top 0.305: U1.15 182.25,35.69 122.05,35.69 112.14,45.59 SPI.1
RC2
  Top 0.305: U1.14 183.64,37.08 184.02,37.47 184.02,41.15 178.56,46.61 112.14,46.61 SPI.2
RC3  (via drill 0.36)
  Top 0.305: v191.01,38.35 192.28,37.08 U1.7 | v109.86,50.8 109.86,51.18 110.62,51.94 SPI.7
  Bottom 0.305: v191.01,38.35 122.3,38.35 v109.86,50.8
RC5
  Top 0.305: R2.7 197.61,34.54 197.61,34.04 R2.6 197.61,33.78 197.61,33.27 R2.5 197.23,32.89 197.23,32.13 196.6,31.5 196.09,31.5 193.55,34.04 U1.5
RC6  (via drill 0.36)
  Top 0.305: v207.9,24.89 207.9,25.53 U3.2 | v194.94,37.85 193.67,37.85 U1.8
  Bottom 0.305: v207.9,24.89 TP10.TP 207.52,26.42 196.09,37.85 v194.94,37.85
RC7  (via drill 0.36)
  Top 0.305: v191.64,39.12 192.28,39.12 U1.9 | v112.78,50.16 112.14,50.8 SPI.6
  Bottom 0.305: v191.64,39.12 123.83,39.12 v112.78,50.16
VCAP  (via drill 0.76)
  Top 0.61: v194.69,39.5 195.2,40.01 195.71,40.01 R1.1 | VCAP.TP 6.35,1.91 6.35,4.19 17.65,15.49 S1.1 18.29,18.03 18.29,21.08 DISPWR.2 18.42,22.61 19.05,23.24 19.43,23.24 22.23,26.04 22.23,48.9 21.08,50.04 19.18,50.04 3VCHRG.1
  Bottom 0.61: v194.69,39.5 194.31,39.5 173.48,18.67 20.57,18.67 19.3,17.4 S1.1 TP3.TP
VCC  (via drill 0.76)
  Top 0.61: 1.78,14.86 1.78,31.37 4.19,33.78 3VOUT.1 | 1.78,14.86 1.78,1.91 VCC.TP | v194.94,9.4 ICSP.2 | APPLICATION.2 183.77,18.03 190.88,18.03 APPLICATION.1 | v192.41,16.38 192.41,17.4 APPLICATION.1 | DISP3V.2 v190.25,63.5 190.75,63.75 192.41,63.75 193.55,64.9 195.71,64.9 196.34,64.26 16F690.2 197.1,62.87 201.42,62.87 201.68,62.74 | 199.14,37.34 197.99,37.34 R1.5 | 199.14,37.34 201.68,39.88 201.68,62.74 | 201.68,62.74 XBEE.2 | APPLICATION.1 192.91,18.67 194.06,18.67 196.09,20.7 197.87,20.7 199.26,22.1 199.26,37.08 199.14,37.34 | v9.14,14.86 1.78,14.86
  Bottom 0.61: v194.94,9.4 X2.PAD 194.56,11.18 194.56,14.22 193.74,15.05 | v192.41,16.38 193.74,15.05 | TP4.TP v190.25,63.5 | v9.14,14.86 193.55,14.86 193.74,15.05
VREF  (via drill 0.36)
  Top 0.152: R1.2 196.09,38.99 196.09,38.48 R1.3 196.09,38.23 196.09,37.72 R1.4 195.71,37.34 v195.2,36.83 | v186.94,27.3 186.31,27.3 C7.1
  Bottom 0.152: v195.2,36.83 194.18,36.83 186.94,29.59 v186.94,27.3
XBEE-VCC  (via drill 0.76)
  Top 0.61: v204.22,65.66 204.22,64.26 XBEE.1
  Bottom 0.61: 204.22,68.2 204.22,72.77 205.49,74.04 XB1.14 | v204.22,65.66 204.22,68.2 | XB1.1 184.28,85.98 185.67,84.58 185.67,68.45 185.93,68.2 204.22,68.2

### Text on the board
tPlace: + | - | Radish | Beta 11 | http://code.google.com/p/radishdisplay/ | + | -
tNames: GRN | BLK | ON | OFF
Document: Mitre radius??? | Mitre radius???